# EAGLE design controller (EAGLE 5.06)
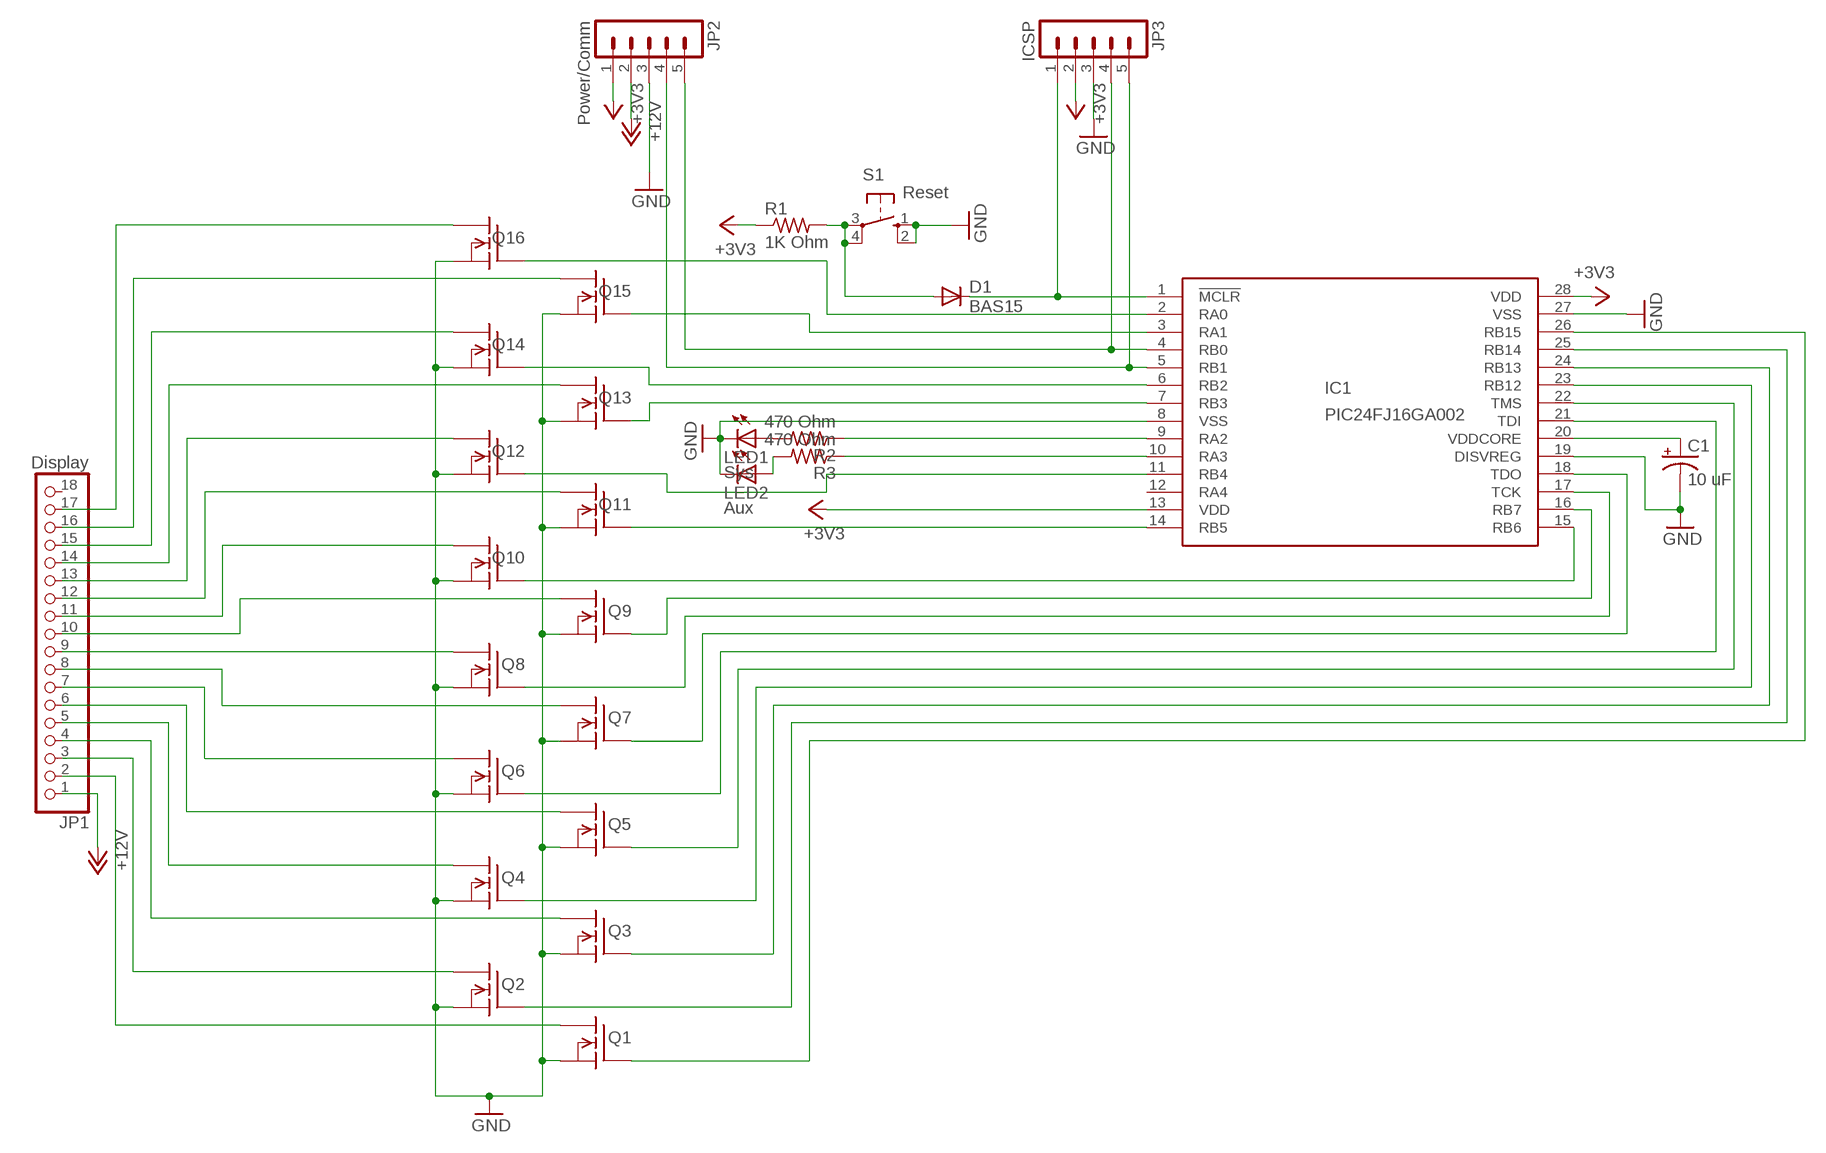
[diagram p0: schematic, sheet 1]

## Parts
C1  10 uF  CPOL-USE1.8-4  [E1,8-4]
D1  BAS15  [DO34-7]
IC1  PIC24FJ16GA002  [DIL28-3]
JP1  Display  PINHD-1X18  [1X18]
JP2  Power/Comm  MAR05-1  [MAR05-1]
JP3  ICSP  MAR05-1  [MAR05-1]
LED1  Sys  LED3MM  [LED3MM]
LED2  Aux  LED3MM  [LED3MM]
Q1  BSS101INLINE  [TO92-]
Q2  BSS101INLINE  [TO92-]
Q3  BSS101INLINE  [TO92-]
Q4  BSS101INLINE  [TO92-]
Q5  BSS101INLINE  [TO92-]
Q6  BSS101INLINE  [TO92-]
Q7  BSS101INLINE  [TO92-]
Q8  BSS101INLINE  [TO92-]
Q9  BSS101INLINE  [TO92-]
Q10  BSS101INLINE  [TO92-]
Q11  BSS101INLINE  [TO92-]
Q12  BSS101INLINE  [TO92-]
Q13  BSS101INLINE  [TO92-]
Q14  BSS101INLINE  [TO92-]
Q15  BSS101INLINE  [TO92-]
Q16  BSS101INLINE  [TO92-]
R1  1K Ohm  R-US_0309/12  [0309/12]
R2  470 Ohm  R-US_0309/12  [0309/12]
R3  470 Ohm  R-US_0309/12  [0309/12]
S1  Reset  10-XX  [B3F-10XX]

## Nets
+3V3: IC1.13(VDD) IC1.28(VDD) JP2.1 JP3.2 R1.1
+12V: JP1.1 JP2.2
GND: C1.- IC1.8(VSS) IC1.19(DISVREG) IC1.27(VSS) JP2.3 JP3.3 LED1.K(C) LED2.K(C) Q1.3(S) Q2.3(S) Q3.3(S) Q4.3(S) Q5.3(S) Q6.3(S) Q7.3(S) Q8.3(S) Q9.3(S) Q10.3(S) Q11.3(S) Q12.3(S) Q13.3(S) Q14.3(S) Q15.3(S) Q16.3(S) S1.1(S) S1.2(S1)
N$1: IC1.2(RA0) Q16.2(G)
N$2: IC1.3(RA1) Q15.2(G)
N$3: IC1.6(RB2) Q14.2(G)
N$4: IC1.7(RB3) Q13.2(G)
N$5: IC1.11(RB4) Q12.2(G)
N$6: IC1.14(RB5) Q11.2(G)
N$7: IC1.15(RB6) Q10.2(G)
N$8: IC1.16(RB7) Q9.2(G)
N$9: IC1.17(TCK) Q8.2(G)
N$10: IC1.18(TDO) Q7.2(G)
N$11: IC1.21(TDI) Q6.2(G)
N$12: IC1.22(TMS) Q5.2(G)
N$13: IC1.23(RB12) Q4.2(G)
N$14: IC1.24(RB13) Q3.2(G)
N$15: IC1.25(RB14) Q2.2(G)
N$16: IC1.26(RB15) Q1.2(G)
N$17: JP1.10 Q9.1(D)
N$18: JP1.12 Q11.1(D)
N$19: JP1.13 Q12.1(D)
N$20: JP1.11 Q10.1(D)
N$21: JP1.9 Q8.1(D)
N$22: JP1.17 Q16.1(D)
N$23: JP1.16 Q15.1(D)
N$24: JP1.15 Q14.1(D)
N$25: JP1.14 Q13.1(D)
N$26: JP1.8 Q7.1(D)
N$27: JP1.7 Q6.1(D)
N$28: JP1.6 Q5.1(D)
N$29: JP1.5 Q4.1(D)
N$30: JP1.4 Q3.1(D)
N$31: JP1.3 Q2.1(D)
N$32: JP1.2 Q1.1(D)
N$33: D1.C IC1.1(!MCLR) JP3.1
N$34: LED1.A R2.2
N$35: IC1.5(RB1) JP2.4 JP3.5
N$36: IC1.4(RB0) JP2.5 JP3.4
N$37: IC1.9(RA2) R2.1
N$38: C1.+ IC1.20(VDDCORE)
N$39: IC1.10(RA3) R3.1
N$40: LED2.A R3.2
N$41: D1.A R1.2 S1.3(P) S1.4(P1)
Unconnected: IC1.12(RA4) JP1.18

## Library data of the parts
C1 = rcl:CPOL-US: POLARIZED CAPACITOR, American symbol
D1 = diode:BAS15: DIODE high speed
IC1 = microchip:PIC24FJ16GA002: PIC24FJ16GA002 edit this description Auto generated by make-symbol-device-package-bsdl.ulp Rev. 25 Source: PIC24FJ16GA002.bsd
JP1 = pinhead:PINHD-1X18: PIN HEADER
JP2 JP3 = con-lstb:MAR05-1: PIN HEADER
LED1 LED2 = led:LED: LED OSRAM: - CHIPLED LG R971, LG N971, LY N971, LG Q971, LY Q971, LO R971, LY R971 LH N974, LH R974 LS Q976, LO Q976, LY Q976 LO Q996 - Hyper CHIPLED LW Q18S LB Q993, LB Q99A, LB R99A - SideLED LS A670, LO A670, LY A670, LG A670, LP A670 LB A673, LV A673, LT A673, LW A673 LH A674 LY A675 LS A676, LA A676, LO A676, LY A676, LW A676 LS A679, LY A679, LG A679 - Hyper Micro SIDELED® LS Y876, LA Y876, LO Y876, LY Y876 LT Y87S - SmartLED LW L88C, LW L88S LB L89C, LB L89S, LG L890 LS L89K, LO L89K, LY L89K LS L896, LA L896, LO L896, LY L896 - TOPLED LS T670, LO T670, LY T670, LG T670, LP T670 LSG T670, LSP T670, LSY T670, LOP T670, LYG T670 LG T671, LOG T671, LSG T671 LB T673, LV T673, LT T673, LW T673 LH T674 LS T676, LA T676, LO T676, LY T676, LB T676, LH T676, LSB T676, LW T676 LB T67C, LV T67C, LT T67C, LS T67K, LO T67K, LY T67K, LW E67C LS E67B, LA E67B, LO E67B, LY E67B, LB E67C, LV E67C, LT E67C LW T67C LS T679, LY T679, LG T679 LS T770, LO T770, LY T770, LG T770, LP T770 LB T773, LV T773, LT T773, LW T773 LH T774 LS E675, LA E675, LY E675, LS T675 LS T776, LA T776, LO T776, LY T776, LB T776 LHGB T686 LT T68C, LB T68C - Hyper Mini TOPLED® LB M676 - Mini TOPLED Santana® LG M470 LS M47K, LO M47K, LY M47K Source: http://www.osram.convergy.de LUXEON: - LUMILED® LXK2-PW12-R00, LXK2-PW12-S00, LXK2-PW14-U00, LXK2-PW14-V00 LXK2-PM12-R00, LXK2-PM12-S00, LXK2-PM14-U00 LXK2-PE12-Q00, LXK2-PE12-R00, LXK2-PE12-S00, LXK2-PE14-T00, LXK2-PE14-U00 LXK2-PB12-K00, LXK2-PB12-L00, LXK2-PB12-M00, LXK2-PB14-N00, LXK2-PB14-P00, LXK2-PB14-Q00 LXK2-PR12-L00, LXK2-PR12-M00, LXK2-PR14-Q00, LXK2-PR14-R00 LXK2-PD12-Q00, LXK2-PD12-R00, LXK2-PD12-S00 LXK2-PH12-R00, LXK2-PH12-S00 LXK2-PL12-P00, LXK2-PL12-Q00, LXK2-PL12-R00 Source: www.luxeon.com KINGBRIGHT: KA-3528ASYC Source: www.kingbright.com
Q1-Q16 = transistor-fet:BSS101: N-Channel Enhancement MOSFET 200V; 0,16A; 11Ohm
R1-R3 = rcl:R-US_: RESISTOR, American symbol
S1 = switch-omron:10-XX: OMRON SWITCH

## Board
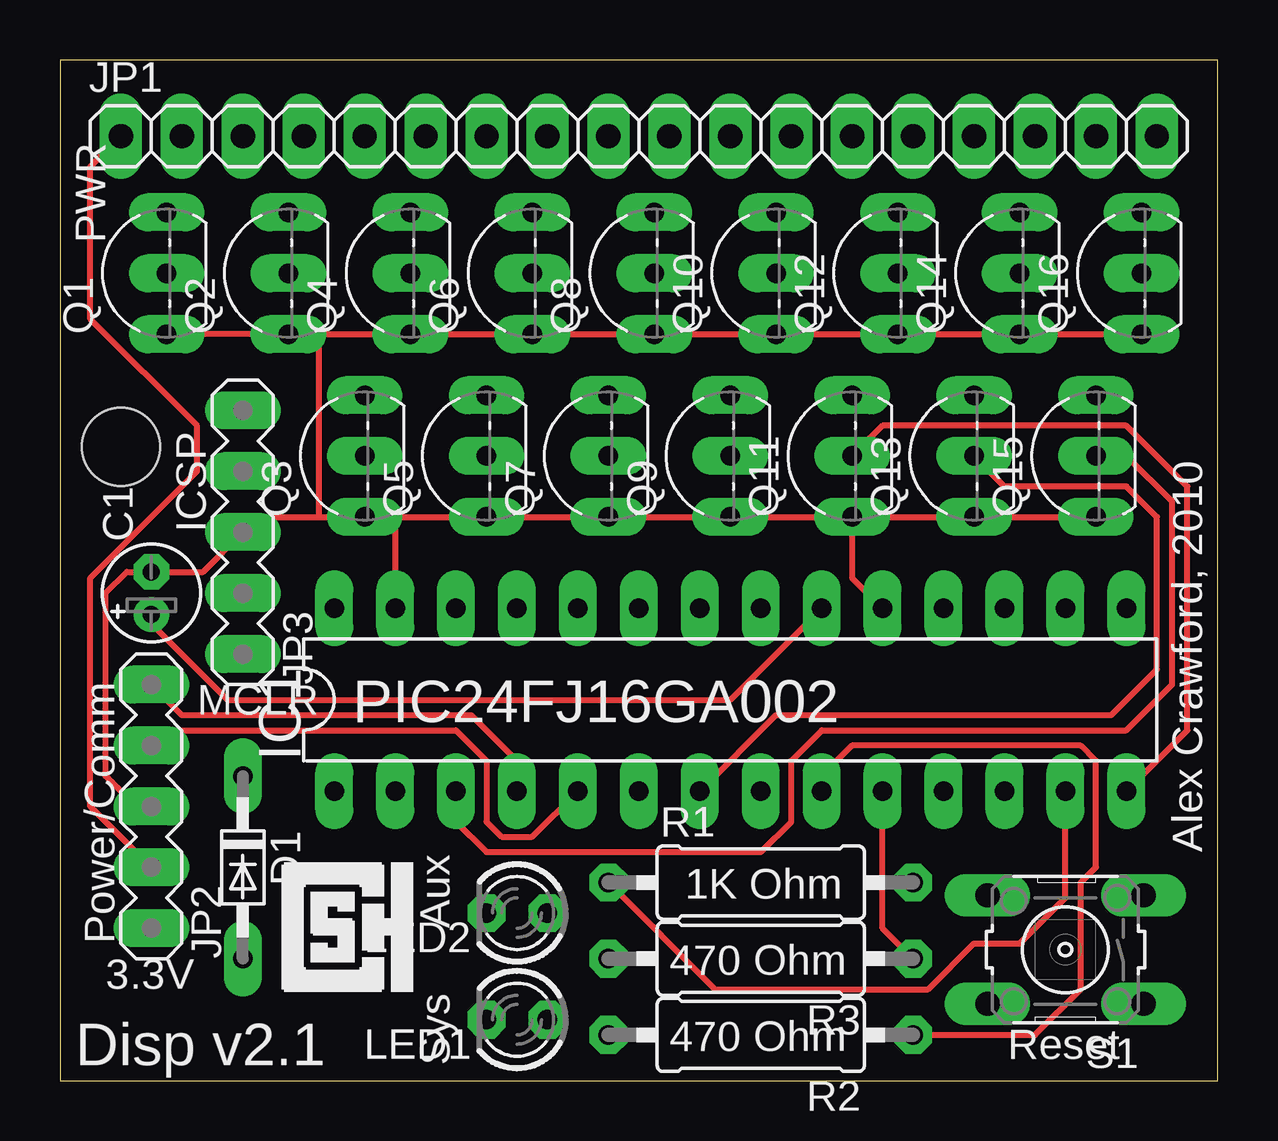
[diagram p1: board, top side]
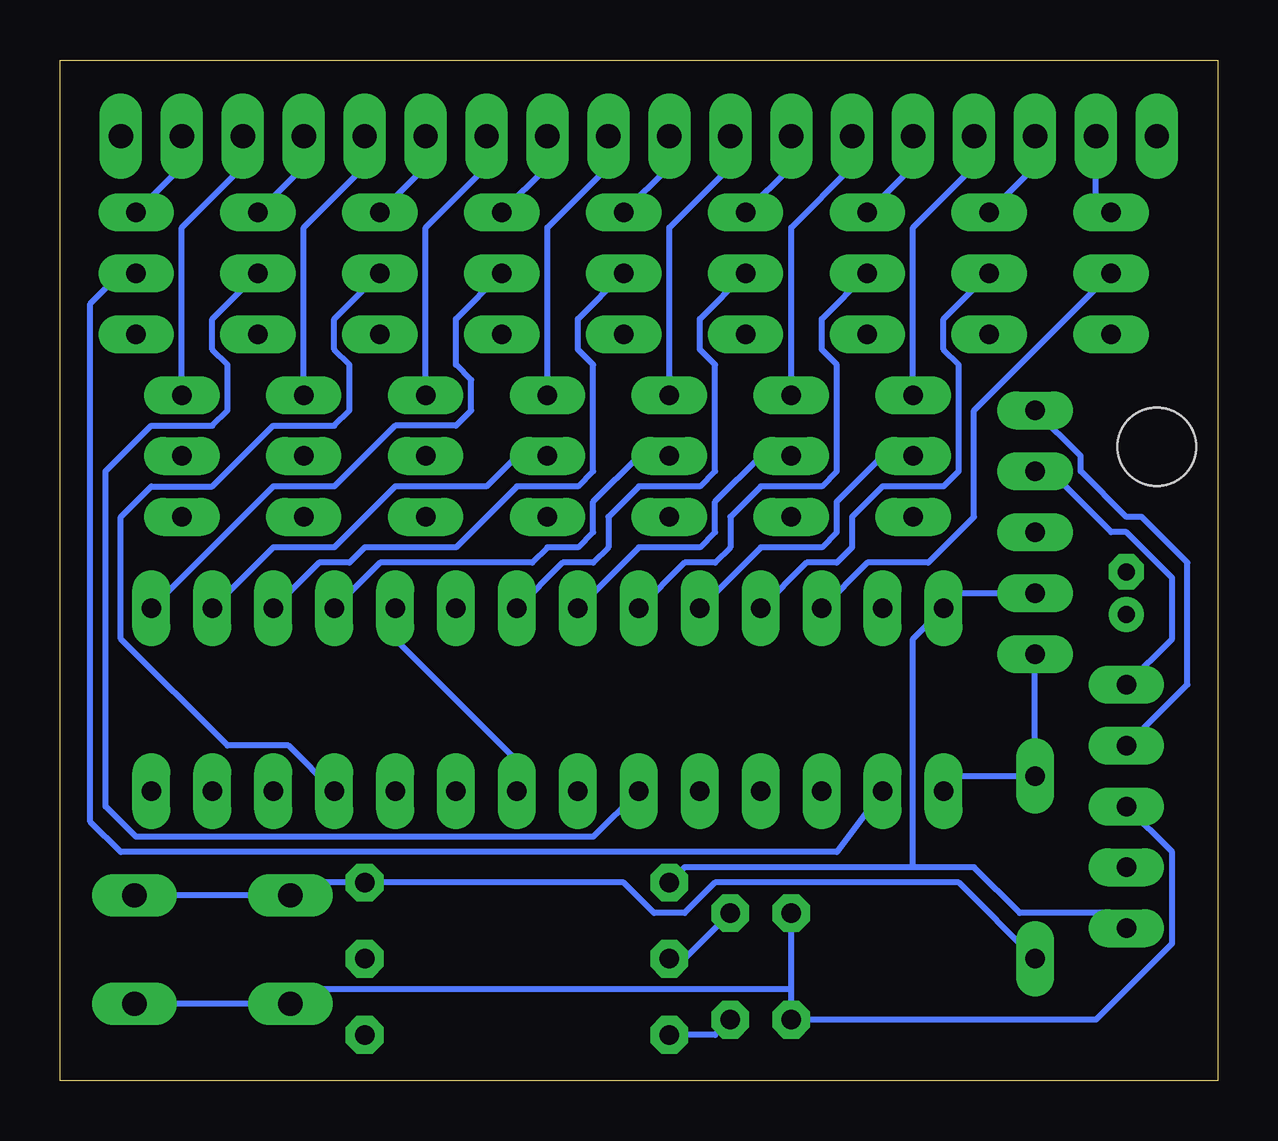
[diagram p2: board, bottom side, seen from below]

Size 48.26 x 42.55 mm. Coordinates in mm from the lower left corner, seen from the top.
Outline: 0,0 48.26,0 48.26,42.55 0,42.55 0,0
Copper layers (1*16): Top 0.035mm / dielectric 1.5mm / Bottom 0.035mm
Design rules "default *": minimum track width 10mil, minimum drill 24mil, track to track 8mil, track to pad 8mil, pad to pad 8mil, via to via 8mil, smd to smd 8mil, copper to edge 40mil, drill to drill 8mil, minimum pad ring 15mil, minimum via ring 15mil, stop-mask expansion 4mil, vias tented up to drill 0mil, thermal gap 10mil
Holes 3.26 mm at 2.54,26.42

### Footprints (pad centres in the part's own frame; a part is rotated, then mirrored left to right if it is on the bottom)
E1,8-4 = drill 0.711 pad 1.168 round: + -0.889,0 | drill 0.711 pad 1.168 octagon: - 0.889,0
DO34-7 = drill 0.813 long: A 3.81,0; C -3.81,0
DIL28-3 = drill 0.813 long: 1 -16.51,-3.81; 2 -13.97,-3.81; 3 -11.43,-3.81; 4 -8.89,-3.81; 5 -6.35,-3.81; 6 -3.81,-3.81; 7 -1.27,-3.81; 8 1.27,-3.81; 9 3.81,-3.81; 10 6.35,-3.81; 11 8.89,-3.81; 12 11.43,-3.81; 13 13.97,-3.81; 14 16.51,-3.81; 15 16.51,3.81; 16 13.97,3.81; 17 11.43,3.81; 18 8.89,3.81; 19 6.35,3.81; 20 3.81,3.81; 21 1.27,3.81; 22 -1.27,3.81; 23 -3.81,3.81; 24 -6.35,3.81; 25 -8.89,3.81; 26 -11.43,3.81; 27 -13.97,3.81; 28 -16.51,3.81
1X18 = drill 1.016 long: 1 -21.59,0; 2 -19.05,0; 3 -16.51,0; 4 -13.97,0; 5 -11.43,0; 6 -8.89,0; 7 -6.35,0; 8 -3.81,0; 9 -1.27,0; 10 1.27,0; 11 3.81,0; 12 6.35,0; 13 8.89,0; 14 11.43,0; 15 13.97,0; 16 16.51,0; 17 19.05,0; 18 21.59,0
MAR05-1 = drill 0.813 long: 1 -5.08,0; 2 -2.54,0; 3 0,0; 4 2.54,0; 5 5.08,0
LED3MM = drill 0.813 octagon: A -1.27,0; K 1.27,0
TO92- = drill 0.813 long: 1 2.54,0; 2 0,0; 3 -2.54,0
0309/12 = drill 0.813 octagon: 1 -6.35,0; 2 6.35,0
B3F-10XX = drill 1.016 long: 1 -3.251,2.261; 2 3.251,2.261; 3 -3.251,-2.261; 4 3.251,-2.261

### Placement (x,y rotation side)
C1  3.81,20.32 90 top
D1  7.62,8.89 270 top
IC1  27.94,15.88 0 top
JP1  24.13,39.37 0 top
JP2  3.81,11.43 90 top
JP3  7.62,22.86 90 top
LED1  19.05,2.54 180 top
LED2  19.05,6.99 180 top
Q1  4.45,33.66 90 top
Q2  9.53,33.66 90 top
Q3  12.7,26.04 90 top
Q4  14.61,33.66 90 top
Q5  17.78,26.04 90 top
Q6  19.68,33.66 90 top
Q7  22.86,26.04 90 top
Q8  24.77,33.66 90 top
Q9  27.94,26.04 90 top
Q10  29.84,33.66 90 top
Q11  33.02,26.04 90 top
Q12  34.92,33.66 90 top
Q13  38.1,26.04 90 top
Q14  40.01,33.66 90 top
Q15  43.18,26.04 90 top
Q16  45.09,33.66 90 top
R1  29.21,8.26 0 top
R2  29.21,1.91 180 top
R3  29.21,5.08 180 top
S1  41.91,5.46 180 top

### Tracks (layer width: path | path; a pad name or v marks a point on that pad's centre or on a via)
+3V3
  Top 0.254: IC1.13 41.91,7.62 40.01,5.71 38.1,5.71 36.2,3.81 27.3,3.81 R1.1
  Bottom 0.254: 12.7,8.89 22.23,8.89 R1.1 | 12.7,8.89 12.7,18.41 IC1.28 10.79,20.32 JP3.2 | 12.7,8.89 10.16,8.89 8.26,6.99 4.45,6.99 JP2.1
+12V
  Top 0.254: JP2.2 1.27,11.43 1.27,20.95 5.71,25.4 5.71,27.3 1.27,31.75 1.27,38.1 JP1.1
GND
  Top 0.254: Q1.3 Q2.3 10.79,31.11 | 10.79,31.11 Q4.3 Q6.3 Q8.3 Q10.3 Q12.3 Q14.3 Q16.3 | 13.97,23.5 Q5.3 Q7.3 Q9.3 Q11.3 | Q11.3 Q13.3 Q15.3 | Q11.3 33.02,20.95 IC1.19 | 10.79,23.5 8.26,23.5 JP3.3 5.97,21.21 C1.- 2.79,21.21 1.91,20.32 1.91,12.7 3.17,11.43 JP2.3 | 10.79,23.5 Q3.3 13.97,23.5 | 13.97,23.5 IC1.27 | 10.79,23.5 10.79,31.11
  Bottom 0.254: IC1.19 34.29,18.41 29.21,13.34 IC1.8 | S1.1 S1.2 38.1,3.81 17.78,3.81 | 17.78,3.81 LED1.K 5.08,2.54 1.91,5.71 1.91,9.53 JP2.3 | 17.78,3.81 LED2.K
N$1
  Bottom 0.254: Q16.2 45.72,33.66 46.99,32.38 46.99,10.79 45.72,9.53 15.88,9.53 IC1.2
N$2
  Top 0.254: Q15.2 44.45,26.04 46.35,24.13 46.35,16.51 44.45,14.61 31.75,14.61 30.48,13.34 30.48,10.79 29.21,9.53 17.78,9.53 16.51,10.79 IC1.3
N$3
  Bottom 0.254: Q14.2 41.91,31.75 41.91,30.48 41.27,29.84 41.27,27.94 41.91,27.3 44.45,27.3 46.35,25.4 46.35,11.43 45.09,10.16 26.04,10.16 IC1.6
N$4
  Top 0.254: Q13.2 39.37,24.77 44.45,24.77 45.72,23.5 45.72,17.14 43.81,15.24 29.84,15.24 IC1.7
N$5
  Bottom 0.254: Q12.2 36.83,31.75 36.83,30.48 36.2,29.84 36.2,27.94 36.83,27.3 39.37,27.3 41.91,24.77 44.45,24.77 45.72,23.5 45.72,18.41 41.27,13.97 38.73,13.97 IC1.11
N$6
  Top 0.254: Q11.2 34.29,27.3 44.45,27.3 46.99,24.77 46.99,14.61 IC1.14
N$7
  Bottom 0.254: Q10.2 31.75,31.75 31.75,29.84 31.11,29.21 31.11,27.94 31.75,27.3 34.29,27.3 36.83,24.77 39.37,24.77 IC1.15
N$8
  Bottom 0.254: Q9.2 29.21,26.04 30.48,24.77 34.29,24.77 36.83,22.23 39.37,22.23 IC1.16
N$9
  Bottom 0.254: Q8.2 26.67,31.75 26.67,30.48 26.04,29.84 26.04,25.4 26.67,24.77 29.21,24.77 31.75,22.23 35.56,22.23 36.2,21.59 37.47,21.59 IC1.17
N$10
  Bottom 0.254: Q7.2 24.13,26.04 26.04,24.13 26.04,22.86 26.67,22.23 27.94,22.23 28.57,21.59 34.92,21.59 IC1.18
N$11
  Bottom 0.254: Q6.2 21.59,31.75 21.59,30.48 20.95,29.84 20.95,25.4 21.59,24.77 24.13,24.77 25.4,23.5 25.4,22.23 26.04,21.59 27.3,21.59 IC1.21
N$12
  Bottom 0.254: Q5.2 19.05,26.04 20.95,24.13 20.95,22.86 21.59,22.23 24.13,22.23 IC1.22
N$13
  Bottom 0.254: Q4.2 16.51,31.75 16.51,30.48 15.88,29.84 15.88,25.4 16.51,24.77 19.05,24.77 20.32,23.5 20.32,22.23 20.95,21.59 22.23,21.59 IC1.23
N$14
  Bottom 0.254: Q3.2 13.97,26.04 15.88,24.13 15.88,22.86 16.51,22.23 19.05,22.23 IC1.24
N$15
  Bottom 0.254: Q2.2 11.43,31.75 11.43,30.48 10.79,29.84 10.79,25.4 11.43,24.77 13.97,24.77 15.24,23.5 15.24,22.23 15.88,21.59 17.14,21.59 IC1.25
N$16
  Bottom 0.254: Q1.2 10.16,27.94 10.16,23.5 12.06,21.59 14.61,21.59 IC1.26
N$17
  Bottom 0.254: JP1.10 25.4,38.1 27.94,35.56 Q9.1
N$18
  Bottom 0.254: JP1.12 30.48,38.1 33.02,35.56 Q11.1
N$19
  Bottom 0.254: JP1.13 33.02,38.1 Q12.1
N$20
  Bottom 0.254: JP1.11 27.94,38.1 Q10.1
N$21
  Bottom 0.254: JP1.9 22.86,38.1 Q8.1
N$22
  Bottom 0.254: JP1.17 43.18,38.1 Q16.1
N$23
  Bottom 0.254: JP1.16 40.64,38.1 43.18,35.56 Q15.1
N$24
  Bottom 0.254: JP1.15 38.1,38.1 Q14.1
N$25
  Bottom 0.254: JP1.14 35.56,38.1 38.1,35.56 Q13.1
N$26
  Bottom 0.254: JP1.8 20.32,38.1 22.86,35.56 Q7.1
N$27
  Bottom 0.254: JP1.7 17.78,38.1 Q6.1
N$28
  Bottom 0.254: JP1.6 15.24,38.1 17.78,35.56 Q5.1
N$29
  Bottom 0.254: JP1.5 12.7,38.1 Q4.1
N$30
  Bottom 0.254: JP1.4 10.16,38.1 12.7,35.56 Q3.1
N$31
  Bottom 0.254: JP1.3 7.62,38.1 Q2.1
N$32
  Bottom 0.254: JP1.2 5.08,36.83 Q1.1
N$33
  Bottom 0.254: IC1.1 10.79,12.7 D1.C JP3.1
N$34
  Bottom 0.254: LED1.A 20.95,1.91 R2.2
N$35
  Top 0.254: JP2.4 4.45,14.61 16.51,14.61 17.78,13.34 17.78,10.79 18.41,10.16 19.68,10.16 IC1.5
  Bottom 0.254: JP2.4 1.27,16.51 1.27,21.59 3.17,23.5 3.81,23.5 5.71,25.4 5.71,26.04 JP3.5
N$36
  Top 0.254: IC1.4 19.05,13.34 17.14,15.24 5.08,15.24 JP2.5
  Bottom 0.254: JP2.5 1.91,18.41 1.91,20.95 3.81,22.86 4.45,22.86 6.99,25.4 JP3.4
N$37
  Top 0.254: IC1.9 31.75,12.7 33.02,13.97 42.55,13.97 43.18,13.34 43.18,8.89 42.55,8.26 42.55,3.81 40.64,1.91 R2.1
N$38
  Top 0.254: IC1.20 27.94,15.88 6.99,15.88 3.81,19.05 C1.+
N$39
  Top 0.254: IC1.10 34.29,6.35 R3.1
N$40
  Bottom 0.254: LED2.A 22.23,5.08 R3.2
N$41
  Bottom 0.254: S1.3 S1.4 38.1,8.26 R1.2 24.77,8.26 23.5,6.99 22.23,6.99 20.95,8.26 10.79,8.26 D1.A

### Text on the board
tPlace: PWR | MCLR | Alex Crawford, 2010 | 3.3V | Disp v2.1